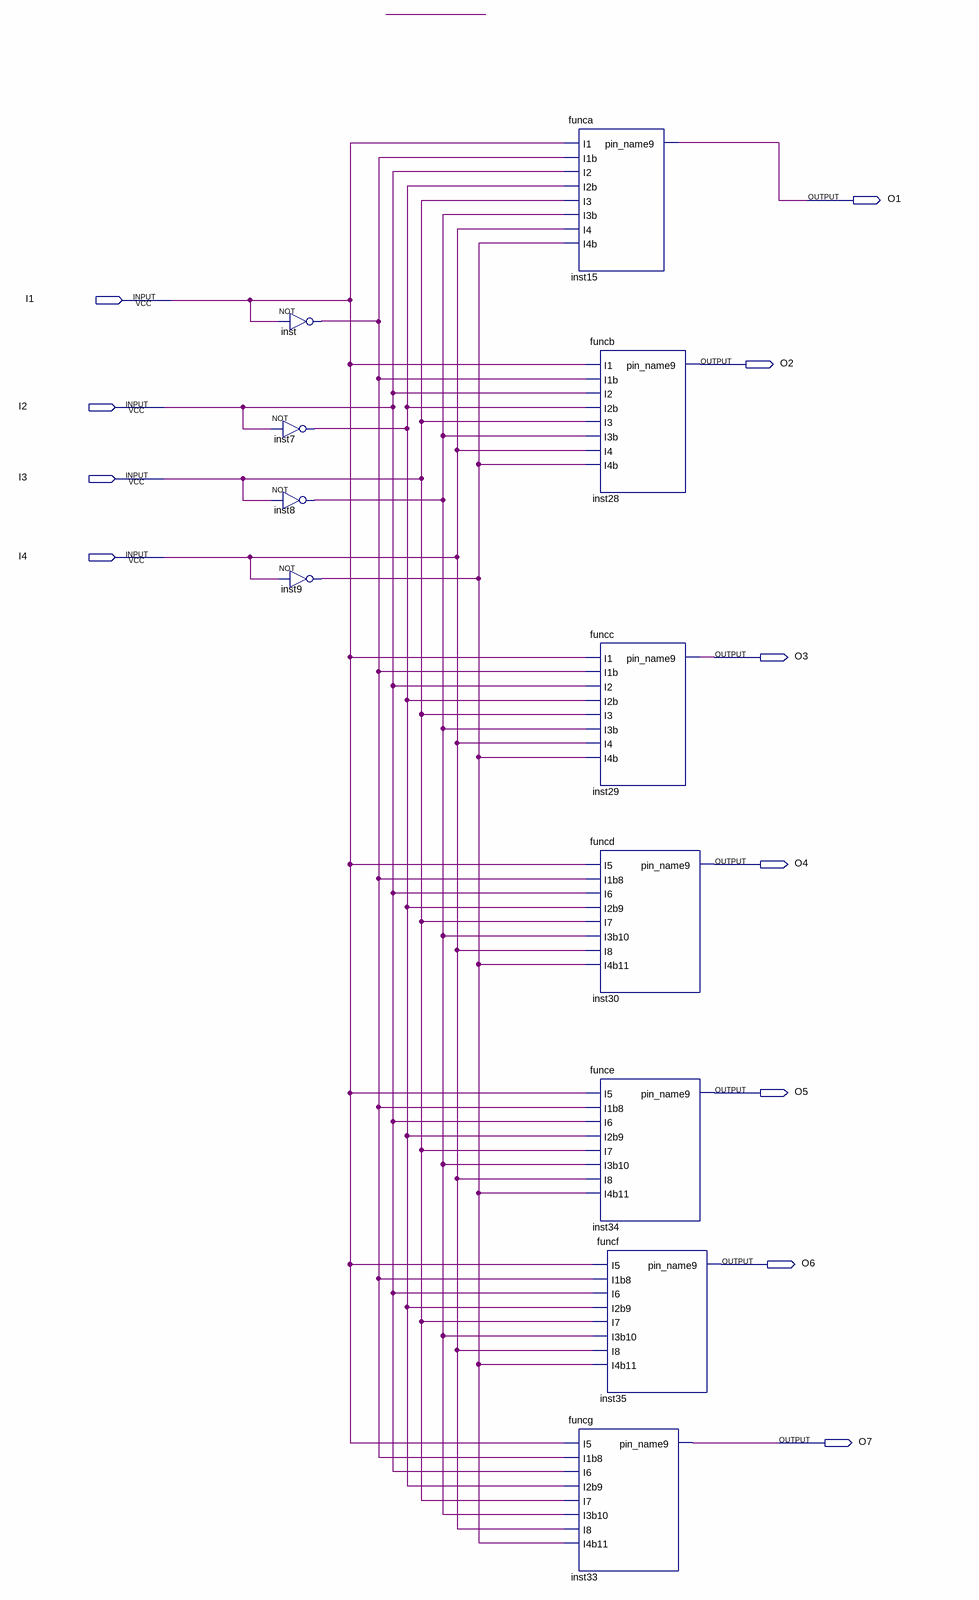
[diagram p0: schematic sheet]
// Quartus schematic func.bdf as structural Verilog: 11 symbols, 11 pins
module func (
  input  I1,
  input  I2,
  input  I3,
  input  I4,
  output O1,
  output O2,
  output O3,
  output O4,
  output O5,
  output O6,
  output O7
);

  wire inst7_out, inst8_out, inst9_out, inst_out;

  not inst7 (inst7_out, I2);
  not inst8 (inst8_out, I3);
  not inst (inst_out, I1);
  not inst9 (inst9_out, I4);
  funca inst15 (
    .I1(I1), .I1b(inst_out), .I2(I2), .I2b(inst7_out), .I3(I3), .I3b(inst8_out), .I4(I4), .I4b(inst9_out),
    .pin_name9(O1));
  funcb inst28 (
    .I1(I1), .I1b(inst_out), .I2(I2), .I2b(inst7_out), .I3(I3), .I3b(inst8_out), .I4(I4), .I4b(inst9_out),
    .pin_name9(O2));
  funcc inst29 (
    .I1(I1), .I1b(inst_out), .I2(I2), .I2b(inst7_out), .I3(I3), .I3b(inst8_out), .I4(I4), .I4b(inst9_out),
    .pin_name9(O3));
  funcd inst30 (
    .I5(I1), .I1b8(inst_out), .I6(I2), .I2b9(inst7_out), .I7(I3), .I3b10(inst8_out), .I8(I4),
    .I4b11(inst9_out), .pin_name9(O4));
  funce inst34 (
    .I5(I1), .I1b8(inst_out), .I6(I2), .I2b9(inst7_out), .I7(I3), .I3b10(inst8_out), .I8(I4),
    .I4b11(inst9_out), .pin_name9(O5));
  funcf inst35 (
    .I5(I1), .I1b8(inst_out), .I6(I2), .I2b9(inst7_out), .I7(I3), .I3b10(inst8_out), .I8(I4),
    .I4b11(inst9_out), .pin_name9(O6));
  funcg inst33 (
    .I5(I1), .I1b8(inst_out), .I6(I2), .I2b9(inst7_out), .I7(I3), .I3b10(inst8_out), .I8(I4),
    .I4b11(inst9_out), .pin_name9(O7));
endmodule
